# Altium schematic sheet [Slave]SX1278.SchDoc: AC
size A4; Author: Nguyen Huu Nghia; CompanyName: MAT; Organization: AD20; Address1: x; Address2: x; Address3: x; Address4: x; DocumentNumber: 1; Revision: V1.0; SheetNumber: 1; SheetTotal: 1
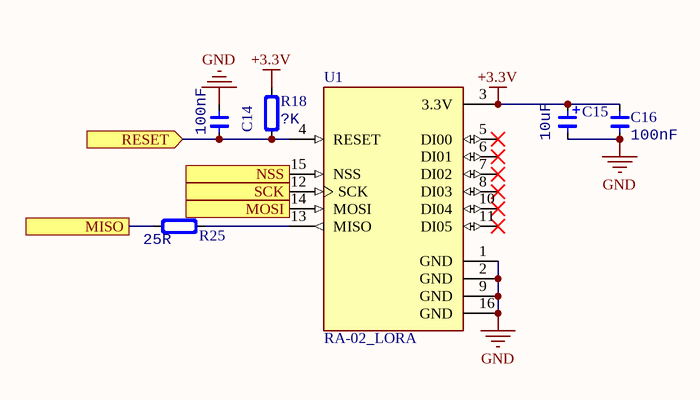
[diagram p0: [Slave]SX1278.SchDoc]

## Parts
C14  value 100nF  [CAP-0603]  (hidden comment: Cap_0603)
C15  value 10uF  [CAP_TAN_1206]  (hidden comment: C1206)
C16  value 100nF  [CAP-0603]  (hidden comment: Cap_0603)
R18  value ?K  [RES-0805]  (hidden comment: R0805)
R25  value 25R  [RES-0805]  (hidden comment: Res_0805)
U1  RA-02_LORA  [MODULE_RA-02_LORA]

## Ports
MISO, MOSI (in), NSS (in), RESET (in), SCK (in)

## Nets
+3.3V: C15.1 C16.2 R18.2 U1.3(3.3V)
GND: C14.1 C15.2 C16.1 U1.1(GND) U1.2(GND) U1.9(GND) U1.16(GND)
MISO: R25.1 ; port MISO
MOSI: U1.14(MOSI) ; port MOSI
NSS: U1.15(NSS) ; port NSS
RESET: C14.2 R18.1 U1.4(RESET) ; port RESET
SCK: U1.12(SCK) ; port SCK
NetR25_2: R25.2 U1.13(MISO)

Not connected (* = marked no-connect by the designer): U1 5(DI00)* 6(DI01)* 7(DI02)* 8(DI03)* 10(DI04)* 11(DI05)*

## Notes on the sheet
- Title
- Size:
- Date:
- A4
- Number:
- Time:
- Revision:
- Sheet
- of
- File:

## Library data of the parts
C14 C16 = Cap_0603: Capacitor; Manufacturer: *; Note: *
C15 = Cap_Tan_1206: Capacitor Tantalum; Manufacturer: *; Note: *
R18 = Res_0805: Resistor; Manufacturer: *; Note: *
R25 = Res_0805: Resistor; Specification: ±1%; Manufacturer: *; Note: *
U1 = RA-02_LORA: Ra-02 LoRa RF M5Stack Platform Evaluation Expansion Board; MF: AI-Thinker; Package: Package; Availability: Unavailable; Value: *; MP: Ra-02 LoRa; Check_prices: https://www.snapeda.com/parts/Ra-02%20LoRa/AI-Thinker/view-part/4449259/?ref=eda; SnapEDA_Link: https://www.snapeda.com/parts/Ra-02%20LoRa/AI-Thinker/view-part/4449259/?ref=snap; Price: None